# EAGLE design MEMS-preamp_v11 (EAGLE 8.5.0)
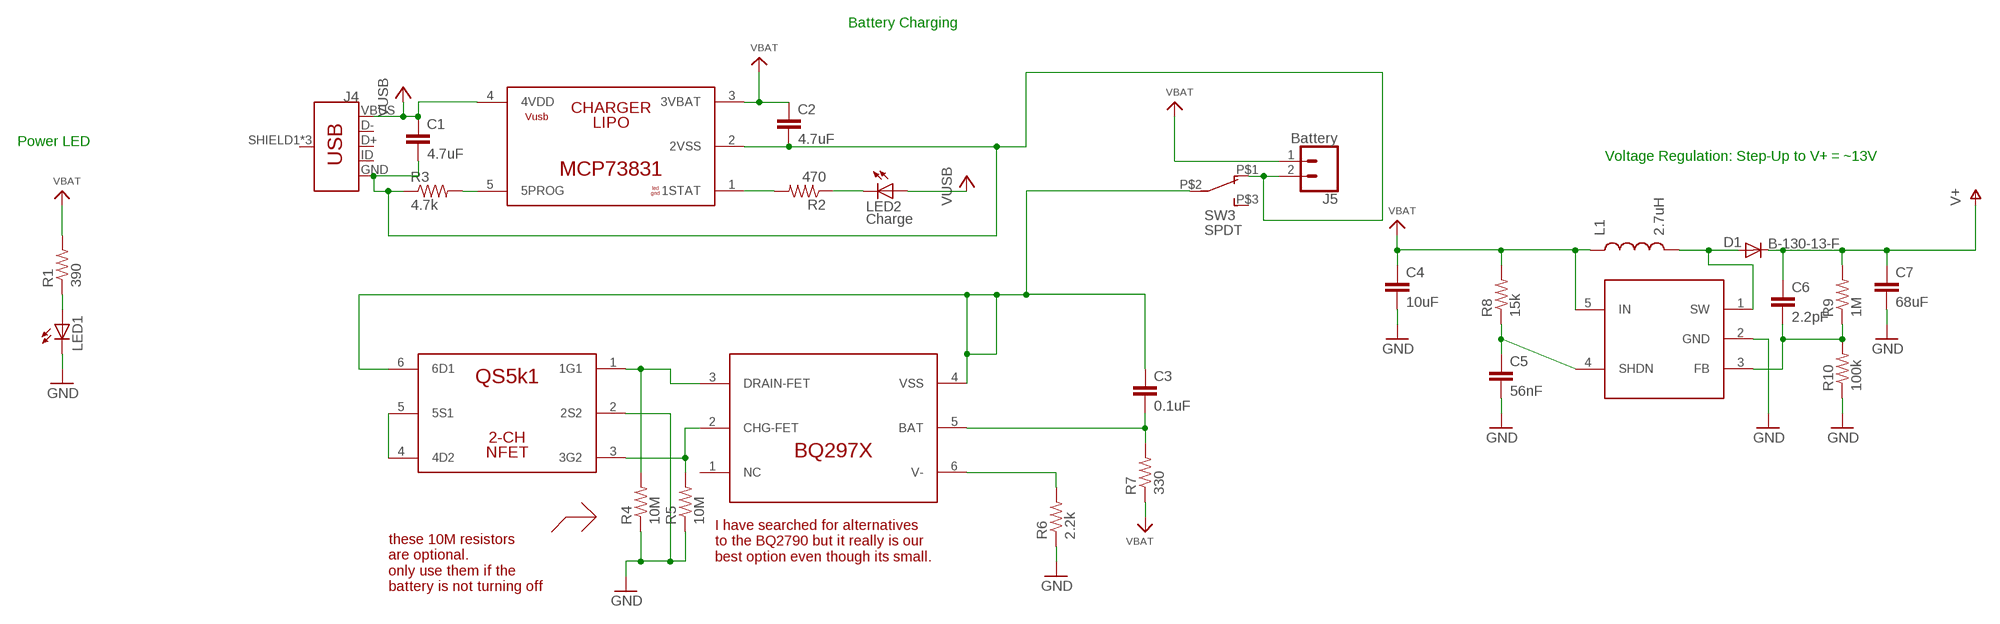
[diagram p0: schematic, sheet 1, part 1 of 2]
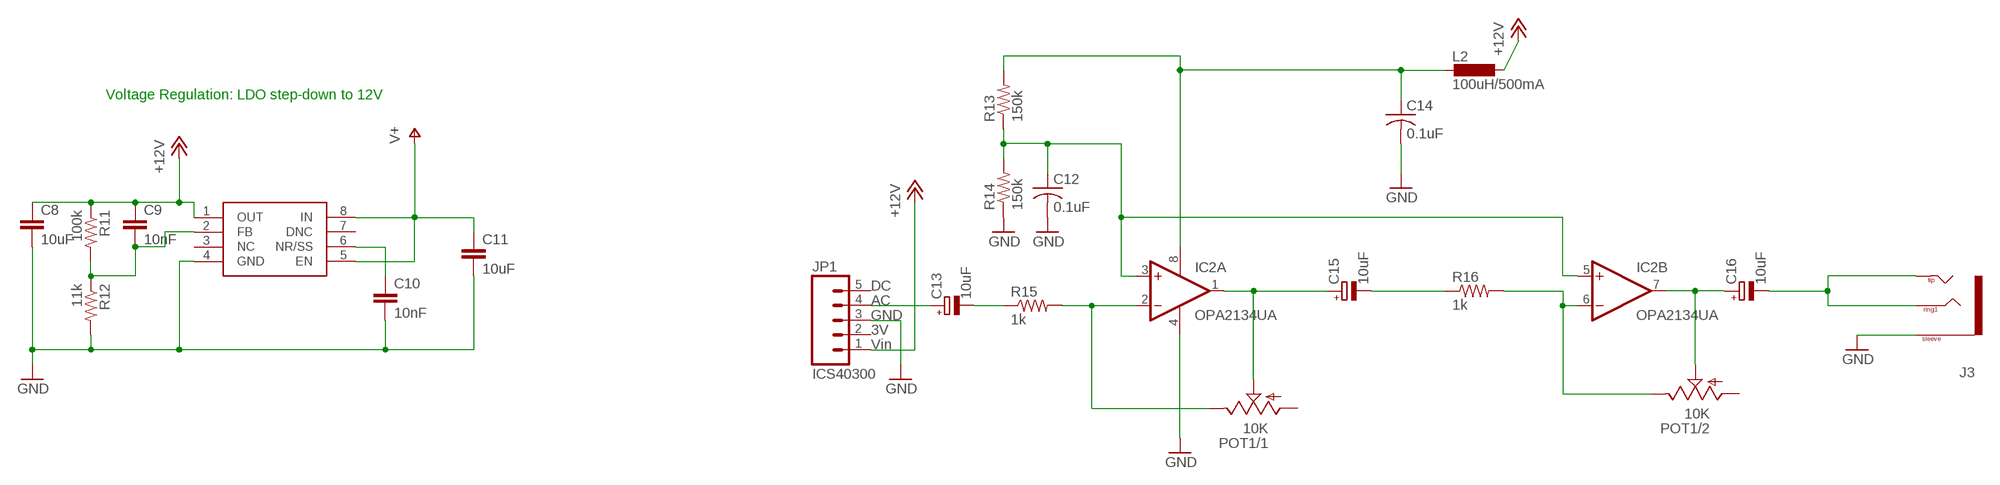
[diagram p1: schematic, sheet 1, part 2 of 2]

## Parts
C1  4.7uF  C-EUC0603  [C0603]
C2  4.7uF  C-EUC0603  [C0603]
C3  0.1uF  C-EUC0603  [C0603]
C4  10uF  C-EUC0603  [C0603]
C5  56nF  C-EUC0603  [C0603]
C6  2.2pF  C-EUC0603  [C0603]
C7  68uF  C-EUC1206  [C1206]
C8  10uF  C-EUC0603  [C0603]
C9  10nF  C-EUC0603  [C0603]
C10  10nF  C-EUC0603  [C0603]
C11  10uF  C-EUC0603  [C0603]
C12  0.1uF  C-USC0805  [C0805]
C13  10uF  CPOL-EUB  [PANASONIC_B]
C14  0.1uF  C-USC0805K  [C0805K]
C15  10uF  CPOL-EUB  [PANASONIC_B]
C16  10uF  CPOL-EUB  [PANASONIC_B]
D1  B-130-13-F  DIODESMA  [SMA-DIODE]
IC1  BQ297X  BQ297X-BATTERY-MANAGERLONG  [WSON-6-LONG]
IC2  OPA2134UA  [SO08]
IC3  MCP73831  [SOT-23-5]
IC4  SC4503  [SOT23-5]
IC5  TPS7A49  [MSOP-8]
IC6  QS6K1  [SOT457R_PHILIPS]
J3  TRS-1/8"-3.5MM  [TRS_SJ-3524-SMT]
J4  USB_MICRO-BREDUCED_PASTE  [USB-B-MICRO-SMD_RED_PASTE]
J5  Battery  CONN_02LOCK  [1X02_LOCK]
JP1  ICS40300  M05LOCK  [1X05_LOCK]
L1  2.7uH  INDUCTORCR54  [CR54]
L2  100uH/500mA  L-EUL3225M  [L3225M]
LED1  LED3MM  [LED3MM]
LED2  Charge  LED3MM  [LED3MM]
POT1  10K  POT-DUAL-PTV112-4420  [PTV112]
R1  390  R-US_R0603  [R0603]
R2  470  R-US_R0603  [R0603]
R3  4.7k  R-US_R0603  [R0603]
R4  10M  R-US_R0603  [R0603]
R5  10M  R-US_R0603  [R0603]
R6  2.2k  R-US_R0603  [R0603]
R7  330  R-US_R0603  [R0603]
R8  15k  R-US_R0603  [R0603]
R9  1M  R-US_R0603  [R0603]
R10  100k  R-US_R0603  [R0603]
R11  100k  R-US_R0603  [R0603]
R12  11k  R-US_R0603  [R0603]
R13  150k  R-US_R0603  [R0603]
R14  150k  R-US_R0603  [R0603]
R15  1k  R-US_R0603  [R0603]
R16  1k  R-US_R0603  [R0603]
SW3  SPDT  SWITCH_SPDTCL-SB-12B  [SWITCH_SPDT_CL-SB-12B]

## Nets
+5V: C1.1 IC3.4(4VDD) J4.VBUS LED2.A ; supply symbol labelled VUSB
+12V: C8.1 C9.1 IC5.1(OUT) JP1.1 L2.1 R11.1
BATGND: C3.1 IC1.4(VSS) IC6.6(6D1) SW3.P$2
GND: C4.2 C5.2 C7.2 C8.2 C10.2 C11.2 C12.2 C14.2 IC2.4(A:V-) IC4.2(GND) IC5.4(GND) IC6.2(2S2) J3.1(SLEEVE) JP1.3 LED1.K(C) R4.1 R5.1 R6.1 R10.1 R12.2 R14.1
N$2: LED1.A R1.1
N$3: C13.+ JP1.4
N$4: C15.- R16.1
N$5: IC2.2(A:-IN) POT1.1.3(/1:E) R15.2
N$6: IC3.5(5PROG) R3.2
N$7: C16.- J3.2(TIP) J3.3(RING1) J3.4(TIP)
N$8: C12.1 IC2.3(A:+IN) IC2.5(B:+IN) R13.1 R14.2
N$9: C15.+ IC2.1(A:OUT) POT1.1.2(/1:S)
N$10: C16.+ IC2.7(B:OUT) POT1.2.2(/2:S)
N$11: IC6.4(4D2) IC6.5(5S1)
N$12: D1.A IC4.1(SW) L1.P$2
N$13: C5.1 IC4.4(SHDN) R8.1
N$14: C6.2 IC4.3(FB) R9.1 R10.2
N$15: C14.1 IC2.8(A:V+) L2.2 R13.2
N$21: IC2.6(B:-IN) POT1.2.3(/2:E) R16.2
N$22: LED2.K(C) R2.1
N$23: C13.- R15.1
N$25: IC3.1(1STAT) R2.2
N$27: IC1.3(DRAIN-FET) IC6.1(1G1) R4.2
N$31: IC1.2(CHG-FET) IC6.3(3G2) R5.2
N$34: IC1.6(V-) R6.2
N$42: C3.2 IC1.5(BAT) R7.2
N$47: C9.2 IC5.2(FB) R11.2 R12.1
N$48: C10.1 IC5.6(NR/SS)
USBGND: C1.2 C2.2 IC3.2(2VSS) J4.GND J5.2 R3.1 SW3.P$1
V+: C6.1 C7.1 C11.1 D1.C IC5.5(EN) IC5.8(IN) R9.2
VBAT: C2.1 C4.1 IC3.3(3VBAT) IC4.5(IN) J5.1 L1.P$1 R1.2 R7.1 R8.2
Unconnected: IC1.1(NC) IC5.3(NC) IC5.7(DNC) J4.D+ J4.D- J4.ID J4.SHIELD1(SHIELD) J4.SHIELD2(SHIELD) J4.SHIELD3(SHIELD) JP1.2 JP1.5 POT1.1.1(/1:A) POT1.2.1(/2:A) SW3.P$3

## Notes on the sheet
- Battery Charging
- Power LED
- Voltage Regulation: Step-Up to V+ = ~13V | Voltage Regulation: LDO step-down to 12V
- I have searched for alternatives 
  to the BQ2790 but it really is our 
  best option even though its small.
- these 10M resistors
  are optional. 
  only use them if the 
  battery is not turning off

## Library data of the parts
C1-C11 = rcl:C-EU: CAPACITOR, European symbol; SPICEPREFIX: C
C12 C14 = adafruit:C-US: CAPACITOR, American symbol
C13 C15 C16 = CMU-ArtFab:CPOL-EU: POLARIZED CAPACITOR, European symbol
D1 = SparkFun:DIODE: Diode These are standard reverse protection diodes and small signal diodes. SMA package can handle up to about 1A. SOD-323 can handle about 200mA. What the SOD-323 package when ordering, there are some mfgs out there that are 5-pin packages.
IC1 = CMU-ArtFab:BQ297X-BATTERY-MANAGER
IC2 = linear:OPA2*: Dual Operational Amplifier Low Power, Single-Supply, Rail-To-Rail Operational Amplifier Source: http://focus.ti.com/lit/ds/symlink/opa2345.pdf http://focus.ti.com .. opa241.pdf http://focus.ti.com/lit/ds/symlink/opa2134.pdf
IC3 = CMU-ArtFab:MCP73831
IC4 = CMU-ArtFab:SC4503
IC5 = CMU-ArtFab:TPS7A49
IC6 = CMU-ArtFab:QS6K1
J3 = CMU-ArtFab:TRS-1/8"-3.5MM
J4 = CMU-ArtFab:USB_MICRO-B: USB Type Micro-B Connector Male/female and PTH/SMT variants SparkFun Products: SparkFun microB USB Breakout <https://www.sparkfun.com/products/12035> SparkFun USB microB Plug Breakout <https://www.sparkfun.com/products/10031> SparkFun ESP8266 Thing <https://www.sparkfun.com/products/13231>; PROD_ID: CONN-11752
J5 = SparkFun-Connectors:CONN_02: Multi connection point. Often used as Generic Header-pin footprint for 0.1 inch spaced/style header connections On any of the 0.1 inch spaced packages, you can populate with these: Break Away Headers - Straight <https://www.sparkfun.com/products/116> (PRT-00116) Break Away Male Headers - Right Angle <https://www.sparkfun.com/products/553> (PRT-00553) Female Headers <https://www.sparkfun.com/products/115> (PRT-00115) Break Away Headers - Machine Pin <https://www.sparkfun.com/products/117> (PRT-00117) Break Away Female Headers - Swiss Machine Pin <https://www.sparkfun.com/products/743> (PRT-00743) For SCREWTERMINALS and SPRING TERMINALS visit here: Screw Terimnals on SparkFun.com <https://www.sparkfun.com/search/results?term=Screw+Terminals> (5mm/3.5mm/2.54mm spacing) This device is also useful as a general connection point to wire up your design to another part of your project. Our various solder wires solder well into these plated through hole pads. Hook-Up Wire - Assortment (Stranded, 22 AWG) <https://www.sparkfun.com/products/11375> (PRT-11375) Hook-Up Wire - Assortment (Solid Core, 22 AWG) <https://www.sparkfun.com/products/11367> (PRT-11367) View the entire wire category on our website here <https://www.sparkfun.com/categories/141> Special notes: Molex polarized connector foot print use with: PRT-08233 with associated crimp pins and housings. 2.54_SCREWTERM for use with PRT-10571. 3.5mm Screw Terminal footprints for PRT-08084 5mm Screw Terminal footprints for use with PRT-08432
JP1 = SparkFun-Connectors:M05: Header 5 Standard 5-pin 0.1" header. Use with straight break away headers (SKU : PRT-00116), right angle break away headers (PRT-00553), swiss pins (PRT-00743), machine pins (PRT-00117), and female headers (PRT-00115). Molex polarized connector foot print use with SKU : PRT-08230 with associated crimp pins and housings.; CON1: Vin; CON2: 3V; CON3: GND; CON4: AC; CON5: DC
L1 = SparkFun-Passives:INDUCTOR: Inductors Basic Inductor/Choke - 0603 and 1206. Footprints are not proven and vary greatly between part numbers. SRN6045- 33uH, 20% 1.4A SDR0403-560KL - 56uH, 10%, 500mA RMS/740mA peak
L2 = rcl:L-EU: INDUCTOR, European symbol; SPICEPREFIX: L
LED1 LED2 = led:LED: LED OSRAM: - CHIPLED LG R971, LG N971, LY N971, LG Q971, LY Q971, LO R971, LY R971 LH N974, LH R974 LS Q976, LO Q976, LY Q976 LO Q996 - Hyper CHIPLED LW Q18S LB Q993, LB Q99A, LB R99A - SideLED LS A670, LO A670, LY A670, LG A670, LP A670 LB A673, LV A673, LT A673, LW A673 LH A674 LY A675 LS A676, LA A676, LO A676, LY A676, LW A676 LS A679, LY A679, LG A679 - Hyper Micro SIDELED® LS Y876, LA Y876, LO Y876, LY Y876 LT Y87S - SmartLED LW L88C, LW L88S LB L89C, LB L89S, LG L890 LS L89K, LO L89K, LY L89K LS L896, LA L896, LO L896, LY L896 - TOPLED LS T670, LO T670, LY T670, LG T670, LP T670 LSG T670, LSP T670, LSY T670, LOP T670, LYG T670 LG T671, LOG T671, LSG T671 LB T673, LV T673, LT T673, LW T673 LH T674 LS T676, LA T676, LO T676, LY T676, LB T676, LH T676, LSB T676, LW T676 LB T67C, LV T67C, LT T67C, LS T67K, LO T67K, LY T67K, LW E67C LS E67B, LA E67B, LO E67B, LY E67B, LB E67C, LV E67C, LT E67C LW T67C LS T679, LY T679, LG T679 LS T770, LO T770, LY T770, LG T770, LP T770 LB T773, LV T773, LT T773, LW T773 LH T774 LS E675, LA E675, LY E675, LS T675 LS T776, LA T776, LO T776, LY T776, LB T776 LHGB T686 LT T68C, LB T68C - Hyper Mini TOPLED® LB M676 - Mini TOPLED Santana® LG M470 LS M47K, LO M47K, LY M47K Source: http://www.osram.convergy.de LUXEON: - LUMILED® LXK2-PW12-R00, LXK2-PW12-S00, LXK2-PW14-U00, LXK2-PW14-V00 LXK2-PM12-R00, LXK2-PM12-S00, LXK2-PM14-U00 LXK2-PE12-Q00, LXK2-PE12-R00, LXK2-PE12-S00, LXK2-PE14-T00, LXK2-PE14-U00 LXK2-PB12-K00, LXK2-PB12-L00, LXK2-PB12-M00, LXK2-PB14-N00, LXK2-PB14-P00, LXK2-PB14-Q00 LXK2-PR12-L00, LXK2-PR12-M00, LXK2-PR14-Q00, LXK2-PR14-R00 LXK2-PD12-Q00, LXK2-PD12-R00, LXK2-PD12-S00 LXK2-PH12-R00, LXK2-PH12-S00 LXK2-PL12-P00, LXK2-PL12-Q00, LXK2-PL12-R00 Source: www.luxeon.com KINGBRIGHT: KA-3528ASYC Source: www.kingbright.com
POT1 = CMU-ArtFab:POT-DUAL-PTV112: Bourns 11mm dual potentiometer; AVAILABILITY: Unavailable; DESCRIPTION: Alt# Tce-10111410; MF: STMicroelectronics; MP: PTV112; PACKAGE: None; PRICE: None
R1-R16 = CMU-ArtFab:R-US_: RESISTOR, American symbol
SW3 = CMU-ArtFab:SWITCH_SPDT

## Board
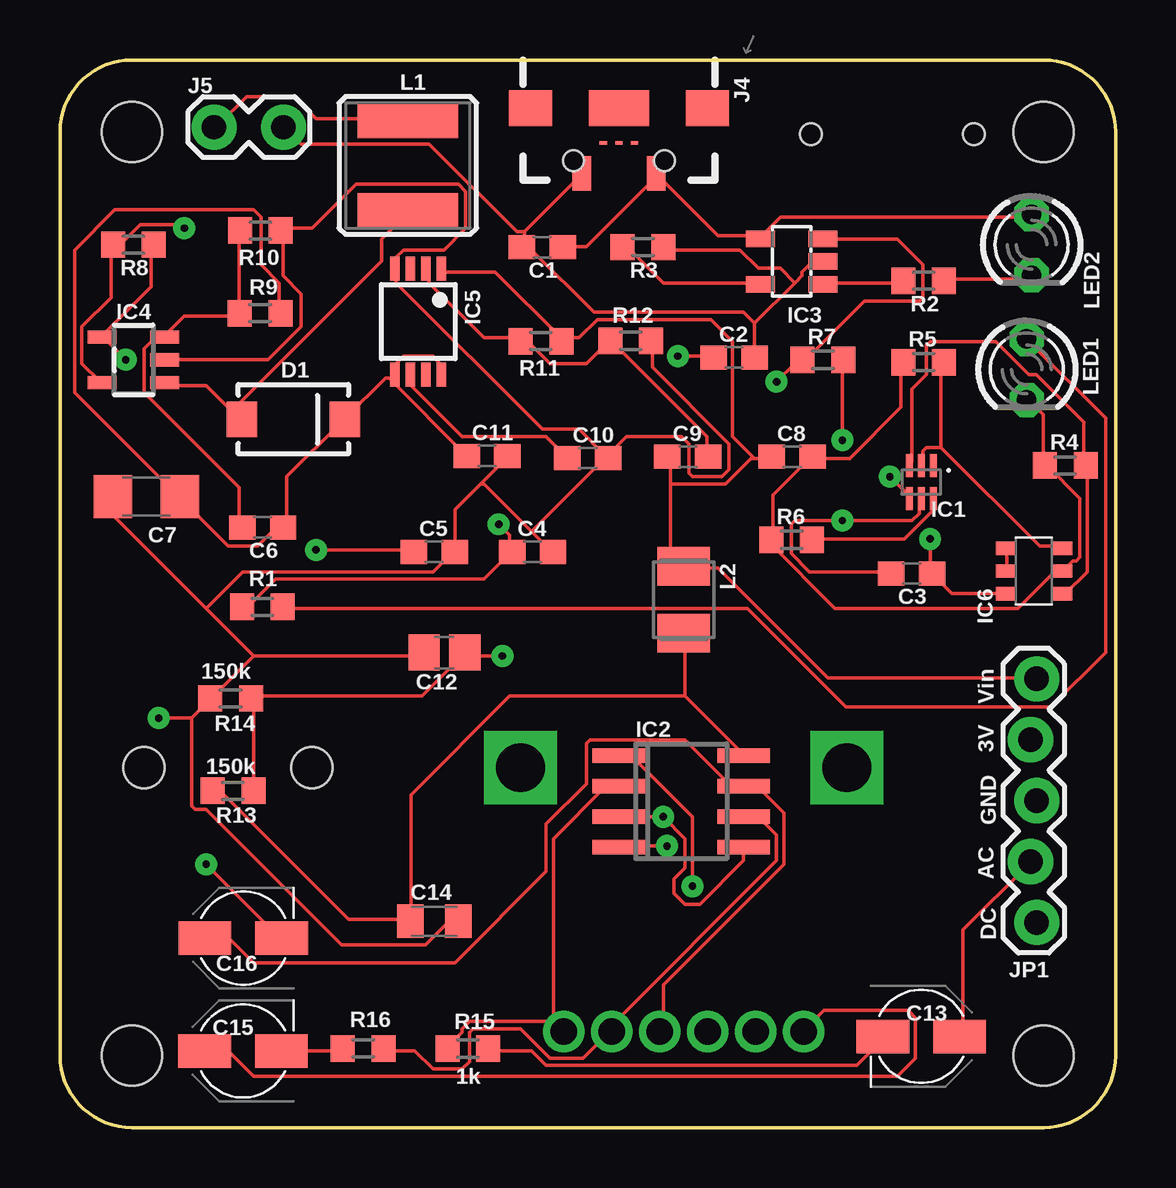
[diagram p2: board, top side]
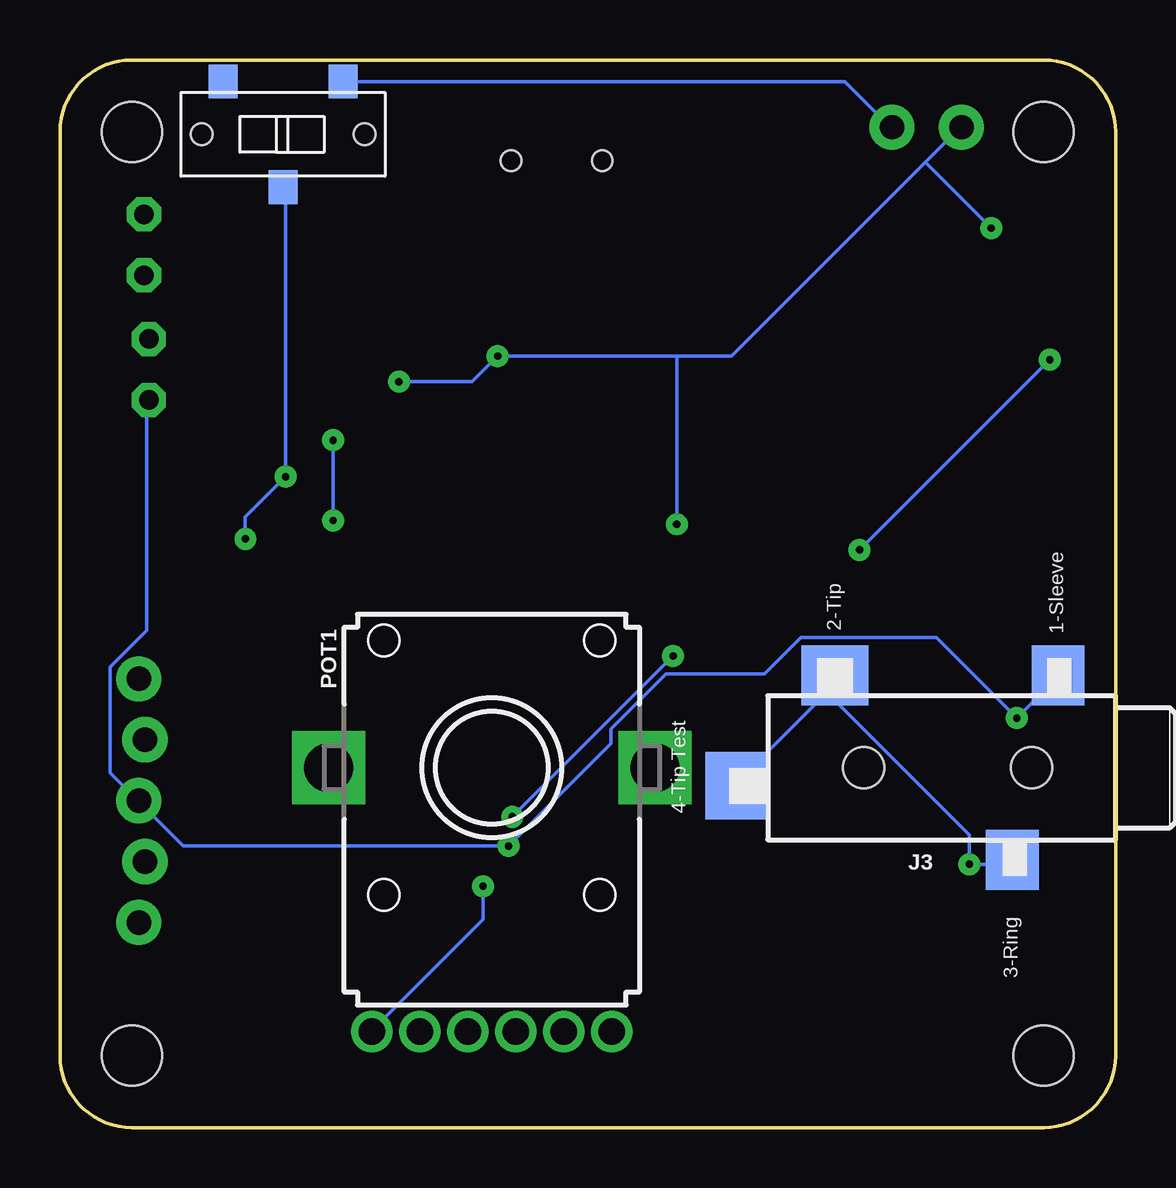
[diagram p3: board, bottom side, seen from below]

Size 44 x 44.5 mm. Coordinates in mm from the lower left corner, seen from the top.
Outline: 0,3 0,41.5 arc-90 3,44.5 41,44.5 arc-90 44,41.5 44,3 arc-90 41,0 3,0 arc-90 0,3
Copper layers (1*16): Top 0.035mm / dielectric 1.5mm / Bottom 0.035mm
Design rules "default *": minimum track width 6mil, minimum drill 12mil, track to track 6mil, track to pad 6mil, pad to pad 6mil, via to via 6mil, smd to smd 6mil, copper to edge 6mil, drill to drill 6mil, minimum pad ring 12mil, minimum via ring 12mil, stop-mask expansion 4mil, vias tented up to drill 0mil, thermal gap 10mil
Holes 2.5 mm at 41,41.5 41,3 3,41.5 3,3

### Footprints (pad centres in the part's own frame; a part is rotated, then mirrored left to right if it is on the bottom)
C0603 = smd 1.1 x 1: 1 -0.85,0; 2 0.85,0
C1206 = smd 1.6 x 1.8: 1 -1.4,0; 2 1.4,0
C0805 = smd 1.3 x 1.5: 1 -0.85,0; 2 0.85,0
PANASONIC_B = smd 2.2 x 1.4: + 1.6,0; - -1.6,0
C0805K = smd 1.1 x 1.4: 1 -1,0; 2 1,0
SMA-DIODE = smd 1.27 x 1.47: A -2.15,0; C 2.15,0
WSON-6-LONG = smd 0.3 x 0.954: 1 -0.5,-0.686; 2 0,-0.686; 3 0.5,-0.686; 4 0.5,0.686; 5 0,0.686; 6 -0.5,0.686
SO08 = smd 0.6 x 2.2: 1 -1.905,-2.6; 2 -0.635,-2.6; 3 0.635,-2.6; 4 1.905,-2.6; 5 1.905,2.6; 6 0.635,2.6; 7 -0.635,2.6; 8 -1.905,2.6
SOT-23-5 = smd 0.69 x 1.2: 1 -0.95,-1.3; 2 0,-1.3; 3 0.95,-1.3; 4 0.95,1.3; 5 -0.95,1.3
SOT23-5 = smd 0.55 x 1.2: 1 -0.95,-1.3; 2 0,-1.3; 3 0.95,-1.3; 4 0.95,1.3; 5 -0.95,1.3
MSOP-8 = smd 0.4 x 1: 1 -0.975,-2.2; 2 -0.325,-2.2; 3 0.325,-2.2; 4 0.975,-2.2; 5 0.975,2.2; 6 0.325,2.2; 7 -0.325,2.2; 8 -0.975,2.2
SOT457R_PHILIPS = smd 0.55 x 0.8: 1 -0.95,-1.2; 2 0,-1.2; 3 0.95,-1.2; 4 0.95,1.2; 5 0,1.2; 6 -0.95,1.2
TRS_SJ-3524-SMT = smd 2.5 x 2.2: 1 3.85,-4.6; 3 -3.85,-2.7 | smd 2.5 x 2.8: 2 3.85,4.7 | smd 2.8 x 2.5: 4 -0.75,8.85 | hole 1.7: 0,-3.5; 0,3.5
USB-B-MICRO-SMD_RED_PASTE = smd 0.152 x 0.305: D+ 1.455,0; D- 1.455,0.65; ID 1.455,-0.65 | smd 1.45 x 0.762: GND 2.725,-1.554 | smd 1.5 x 1.8: SHIELD1 0,3.685; SHIELD2 0,-3.685 | smd 1.5 x 2.5: SHIELD3 0,0 | smd 1.45 x 0.781: VBUS 2.725,1.554 | hole 0.85: 2.2,1.9; 2.2,-1.9
1X02_LOCK = drill 1.016 pad 1.88: 1 -0.178,0; 2 2.718,0
1X05_LOCK = drill 1.016 pad 1.88: 1 0,0.127; 2 2.54,-0.127; 3 5.08,0.127; 4 7.62,-0.127; 5 10.16,0.127
CR54 = smd 4.2 x 1.4: P$1 0,1.85; P$2 0,-1.85
L3225M = smd 1.6 x 2.2: 1 -1.4,0; 2 1.4,0
LED3MM = drill 0.813 octagon: A -1.27,0; K 1.27,0
PTV112 = drill 1.1 pad 1.676: 1.1 -3,-11; 1.2 -5,-11; 1.3 5,-11; 2.1 -1,-11; 2.2 1,-11; 2.3 3,-11 | drill 2.032 pad 2.8 square: M1 -6.8,0; M2 6.8,0
R0603 = smd 1 x 1.1: 1 -0.85,0; 2 0.85,0
SWITCH_SPDT_CL-SB-12B = smd 1.2 x 1.4: P$1 -2.5,-2.2; P$2 0,2.2; P$3 2.5,-2.2 | hole 0.9: -3.4,0; 3.4,0

### Placement (x,y rotation side)
C1  20.1,36.7 180 top
C2  28.1,32.1 0 top
C3  35.5,23.1 180 top
C4  19.7,24 0 top
C5  15.6,24 0 top
C6  8.45,25.02 180 top
C7  3.6,26.3 180 top
C8  30.52,27.96 0 top
C9  26.17,27.96 0 top
C10  22,27.9 0 top
C11  17.8,28 0 top
C12  16.03,19.8 180 top
C13  35.9,3.8 0 top
C14  15.6,8.6 0 top
C15  7.63,3.19 180 top
C16  7.64,7.9 180 top
D1  9.73,29.53 0 top
IC1  35.9,26.9 180 top
IC2  25.9,13.6 270 top
IC3  30.5,36.1 90 top
IC4  3.06,32 90 top
IC5  14.93,33.59 180 top
IC6  40.6,23.2 90 top
J3  7,15 90 bottom
J4  23.3,42.5 270 top
J5  6.6,41.7 0 top
JP1  40.59,18.7 270 top
L1  14.5,40.1 0 top
L2  26,22 270 top
LED1  40.3,31.6 270 top
LED2  40.5,36.8 270 top
POT1  26,15 0 bottom
R1  8.44,21.7 180 top
R2  36,35.3 180 top
R3  24.3,36.7 180 top
R4  41.9,27.6 0 top
R5  36,31.9 0 top
R6  30.5,24.5 0 top
R7  31.8,32 0 top
R8  3.06,36.8 180 top
R9  8.34,33.94 0 top
R10  8.35,37.39 180 top
R11  20.05,32.77 180 top
R12  23.79,32.79 0 top
R13  7.21,14.04 180 top
R14  7.11,17.89 0 top
R15  17,3.29 180 top
R16  12.64,3.29 0 top
SW3  34.7,41.4 180 bottom

### Tracks (layer width: path | path; a pad name or v marks a point on that pad's centre or on a via)
+5V
  Top 0.152: C1.1 21.03,36.73 21.95,36.73 24.84,39.62 J4.VBUS 24.99,39.62 27.43,37.19 29.11,37.19 IC3.4 29.26,37.19 30.02,37.95 40.39,37.95 LED2.A
+12V
  Top 0.152: IC5.1 16,35.66 18.14,35.66 20.88,32.92 R11.1 21.03,32.92 21.64,32.92 22.4,33.68 27.13,33.68 28.04,32.77 28.04,28.8 28.96,27.89 | 25.45,26.82 25.45,23.93 25.91,23.47 L2.1 26.06,23.32 27.43,23.32 32,18.75 40.69,18.75 JP1.1 | 25.45,26.82 25.45,27.89 C9.1 | 28.96,27.89 28.8,27.89 27.74,26.82 25.45,26.82 | 28.96,27.89 29.57,27.89 C8.1
BATGND  (via drill 0.3)
  Top 0.152: IC6.6 39.32,22.25 37.19,22.25 36.42,23.01 C3.1 36.27,23.16 v36.27,24.54 | v34.59,27.13 35.36,26.36 IC1.4
  Bottom 0.152: SW3.P$2 34.59,39.17 v34.59,27.13 36.27,25.45 v36.27,24.54
GND  (via drill 0.3)
  Top 0.152: LED1.K 40.39,30.33 41,29.72 41,27.74 R4.1 41.15,27.58 42.52,26.21 42.52,23.77 42.37,23.62 42.22,23.62 41.91,23.32 IC6.2 41.76,23.16 41.45,23.16 39.93,21.64 32.31,21.64 29.57,24.38 R6.1 29.72,24.54 29.72,26.36 31.24,27.89 C8.2 31.39,27.89 32.92,27.89 35.05,30.02 35.05,31.85 R5.1 | v25.3,11.73 23.32,11.73 IC2.4 | 8.08,19.66 6.4,17.98 R14.1 6.25,17.83 5.49,17.07 | 8.08,19.66 15.09,19.66 C12.2 | 5.49,17.07 5.49,13.41 5.64,13.26 6.1,13.26 11.73,7.62 15.24,7.62 16.15,8.53 16.46,8.53 C14.2 | 8.08,19.66 6.1,21.64 | 6.1,21.64 2.29,25.45 2.29,26.21 C7.2 | 5.49,17.07 v4.12,17.07 | IC4.2 4.42,32 8.69,32 10.06,33.38 10.06,34.75 9.3,35.51 9.3,37.34 R10.1 9.3,37.49 10.52,37.49 12.34,39.32 16.61,39.32 16.92,39.01 16.92,37.49 16,36.58 14.33,36.58 14.02,36.27 14.02,35.81 IC5.4 14.02,35.66 14.02,35.2 20.12,29.11 21.64,29.11 22.71,28.04 C10.2 | 17.53,26.82 18.59,27.89 C11.2 | 17.53,26.82 16.46,25.76 16.46,24.08 C5.2 16.31,23.93 15.54,23.16 7.62,23.16 6.1,21.64 | 19.66,24.84 17.68,26.82 17.53,26.82 | 19.66,24.84 20.42,24.08 C4.2 | R12.2 24.69,32.77 24.69,31.7 27.89,28.5 27.89,27.43 27.58,27.13 26.36,27.13 26.21,27.28 26.21,28.5 25.91,28.8 23.62,28.8 22.86,28.04 C10.2 | 19.66,24.84 22.71,27.89 C10.2
  Bottom 0.152: LED1.K 40.39,30.33 40.39,20.73 41.91,19.2 41.91,14.78 40.84,13.72 JP1.3 40.69,13.56 38.86,11.73 v25.3,11.73 21.03,16 21.03,16.61 18.75,18.9 14.63,18.9 13.11,20.42 7.47,20.42 v4.12,17.07 2.44,18.75 J3.1
N$2
  Top 0.152: R1.1 9.3,21.64 28.65,21.64 32.77,17.53 41.3,17.53 43.59,19.81 43.59,29.57 40.39,32.77 LED1.A
N$3
  Top 0.152: C13.+ 37.64,3.81 37.64,8.23 40.39,10.97 JP1.4
N$4
  Top 0.152: R16.1 11.73,3.2 9.3,3.2 C15.-
N$5
  Top 0.152: 20.57,4.42 17.07,4.42 16.76,4.12 16.76,3.96 16.15,3.35 R15.2 | 20.57,4.42 20.88,4.12 POT1.1.3 20.57,4.42 | 20.57,4.42 20.57,12.04 22.71,14.17 23.16,14.17 IC2.2
N$6
  Top 0.152: R3.2 23.47,36.58 23.77,36.58 25.15,35.2 29.11,35.2 IC3.5
N$7  (via drill 0.3)
  Top 0.152: v6.1,10.97 9.14,7.92 C16.-
  Bottom 0.152: J3.3 4.42,11.12 4.57,10.97 v6.1,10.97 6.1,12.19 12.04,18.14 | 12.04,18.14 15.85,14.33 J3.4 | 12.04,18.14 11.73,18.44 11.73,18.75 J3.2 12.04,18.14
N$8  (via drill 0.3)
  Top 0.152: IC2.3 23.32,12.95 v25.15,12.95 26.06,12.04 26.06,10.82 25.6,10.36 25.6,9.75 26.06,9.3 26.67,9.3 28.5,11.12 28.5,11.58 IC2.5 | R13.1 8.08,14.17 8.08,17.83 R14.2 8.08,17.98 15.09,17.98 16.76,19.66 C12.1 16.92,19.66 v18.44,19.66
  Bottom 0.152: v18.44,19.66 v25.15,12.95
N$9  (via drill 0.3)
  Top 0.152: C15.+ 6.1,3.05 7.16,3.05 8.08,2.13 34.9,2.13 35.66,2.9 35.66,4.57 35.36,4.88 31.85,4.88 31.09,4.12 POT1.1.2 | v26.36,10.06 26.36,12.95 23.93,15.39 23.32,15.39 IC2.1
  Bottom 0.152: v26.36,10.06 26.36,8.69 30.94,4.12 POT1.1.2
N$10
  Top 0.152: C16.+ 6.1,7.77 7.16,7.77 8.08,6.86 16.46,6.86 20.27,10.67 20.27,12.65 21.95,14.33 21.95,16 22.1,16.15 26.06,16.15 27.89,14.33 28.5,14.33 IC2.7 28.65,14.17 29.11,14.17 30.18,13.11 30.18,10.97 25.15,5.94 25.15,4.12 POT1.2.2
N$11
  Top 0.152: IC6.5 39.47,23.32 39.47,24.08 IC6.4
N$12
  Top 0.152: 7.16,29.87 7.47,29.57 D1.A 7.16,29.87 | 7.16,29.87 6.1,30.94 4.42,30.94 IC4.1 | 7.16,29.87 13.41,36.12 13.41,37.03 14.48,38.1 L1.P$2
N$13  (via drill 0.3)
  Top 0.152: v10.67,24.08 14.63,24.08 C5.1 | v2.74,32 1.83,32.92 IC4.4 1.83,33.07 3.81,35.05 3.81,36.73 R8.1
  Bottom 0.152: v2.74,32 v10.67,24.08
N$14
  Top 0.152: R10.2 7.47,37.34 7.47,33.98 R9.1 7.47,33.83 5.18,33.83 4.42,33.07 IC4.3 4.27,32.92 3.96,32.92 3.5,32.46 3.5,30.63 7.47,26.67 7.47,25.15 C6.2
N$15
  Top 0.152: 26.06,17.98 26.06,20.57 L2.2 | 26.06,17.98 28.5,15.54 IC2.8 | R13.2 6.4,14.02 6.71,14.02 12.04,8.69 14.48,8.69 C14.1 14.63,8.69 14.63,13.87 18.75,17.98 26.06,17.98
N$21
  Top 0.152: R16.2 13.56,3.2 14.78,3.2 15.54,2.44 16.76,2.44 17.07,2.74 17.07,3.96 17.22,4.12 19.2,4.12 20.42,2.9 21.79,2.9 22.86,3.96 POT1.2.3 22.86,4.12 29.87,11.12 29.87,12.19 29.11,12.95 28.65,12.95 IC2.6
N$22
  Top 0.152: R2.1 36.88,35.36 40.23,35.36 40.39,35.51 LED2.K
N$23
  Top 0.152: R15.1 17.98,3.2 19.66,3.2 20.27,2.59 33.22,2.59 34.29,3.66 C13.-
N$25
  Top 0.152: R2.2 35.05,35.2 31.85,35.2 IC3.1
N$27
  Top 0.152: IC6.1 41.91,22.25 42.82,23.16 42.82,27.58 R4.2 42.67,27.74 42.67,29.41 40.69,31.39 40.39,31.39 39.01,32.77 36.27,32.77 36.12,32.61 36.12,31.39 35.51,30.79 35.51,27.74 IC1.3
N$31
  Top 0.152: 36.73,28.35 40.84,24.23 41.76,24.23 IC6.3 | 36.73,28.35 36.12,28.35 35.97,28.19 35.97,27.74 IC1.2 | 36.73,28.35 36.73,31.85 R5.2
N$34
  Top 0.152: IC1.6 36.42,26.21 36.42,25.76 35.2,24.54 31.39,24.54 R6.2
N$42  (via drill 0.3)
  Top 0.152: IC1.5 35.81,26.21 35.81,25.6 35.51,25.3 v32.61,25.3 30.63,25.3 30.48,25.15 30.48,23.93 31.24,23.16 34.59,23.16 C3.2 | v32.61,28.65 32.61,31.85 R7.2
  Bottom 0.152: v32.61,25.3 v32.61,28.65
N$47
  Top 0.152: IC5.2 15.39,35.66 15.39,35.2 17.68,32.92 19.05,32.92 R11.2 19.51,32.77 20.42,31.85 21.95,31.85 22.86,32.77 R12.1 23.01,32.77 26.98,28.8 26.98,28.04 C9.2
N$48
  Top 0.152: IC5.6 14.63,31.24 14.63,30.94 16.76,28.8 20.27,28.8 21.03,28.04 C10.1
USBGND
  Top 0.152: 19.36,37.34 19.36,36.73 C1.2 19.36,36.58 19.66,36.58 22.25,33.98 28.5,33.98 28.96,33.53 | 19.36,37.34 21.64,39.62 J4.GND | 28.96,33.53 28.96,32.16 C2.2 | 30.63,35.2 30.94,35.51 30.94,35.66 31.24,35.97 31.7,35.97 IC3.2 | 30.63,35.2 28.96,33.53 | 30.63,35.2 30.02,35.81 29.11,35.81 28.35,36.58 25.3,36.58 R3.1 | 19.36,37.34 19.05,37.34 15.39,41 10.06,41 9.45,41.6 J5.2
  Bottom 0.152: SW3.P$1 32.16,43.59 11.28,43.59 9.45,41.76 J5.2
V+
  Top 0.152: 13.72,31.24 13.56,31.24 11.89,29.57 D1.C 11.73,29.41 9.45,27.13 9.45,25.15 C6.1 9.3,24.99 8.99,24.99 8.23,24.23 7.01,24.23 5.03,26.21 C7.1 4.88,26.36 0.61,30.63 0.61,36.58 2.29,38.25 8.08,38.25 8.38,37.95 8.38,35.97 9.14,35.2 9.14,33.98 R9.2 | 13.72,31.24 13.87,31.24 IC5.5 14.02,31.39 14.02,31.85 14.33,32.16 15.54,32.16 15.85,31.85 15.85,31.39 IC5.8 | 13.72,31.24 16.92,28.04 C11.1
VBAT  (via drill 0.3)
  Top 0.152: R1.2 7.62,21.79 7.92,21.79 8.99,22.86 17.68,22.86 18.75,23.93 C4.1 18.75,24.08 18.75,24.69 v18.29,25.15 | IC3.3 31.85,37.03 34.9,37.03 35.97,35.97 35.97,34.59 35.81,34.44 33.53,34.44 31.09,32 R7.1 30.94,31.85 30.63,31.85 v29.87,31.09 | IC4.5 1.68,31.09 0.91,31.85 0.91,33.38 2.13,34.59 2.13,36.73 R8.2 2.29,36.88 2.59,36.88 3.35,37.64 5.03,37.64 v5.18,37.49 | v25.76,32.16 27.13,32.16 C2.1 | L1.P$1 14.48,42.06 10.67,42.06 9.75,42.98 7.77,42.98 6.55,41.76 J5.1
  Bottom 0.152: 18.29,32.16 16,32.16 7.92,40.23 | 18.29,32.16 v25.76,32.16 26.82,31.09 v29.87,31.09 | 7.92,40.23 6.55,41.6 J5.1 | 7.92,40.23 v5.18,37.49 | 18.29,32.16 v18.29,25.15

### Text on the board
bValues: ON | OFF